# Altium project LampDimmer.PrjPcb
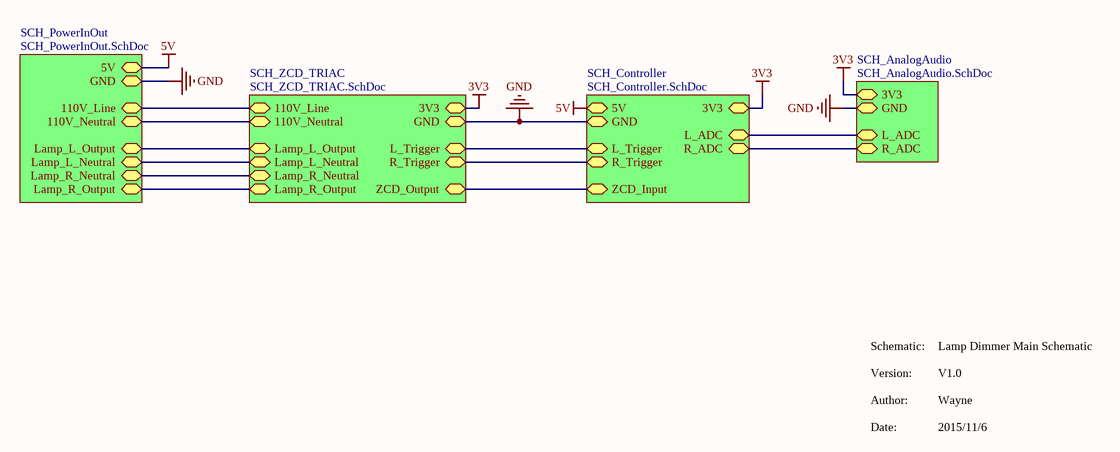
[diagram p0: SCH_Main.SchDoc]
2 sheets, 19 parts. Net scope: hierarchical (ports join the sheet entries above them; power ports are global).
Board file: PCB_LampDimmer.PcbDoc
Sheets:
  SCH_Main.SchDoc
    SCH_AnalogAudio = SCH_AnalogAudio.SchDoc

## Sheet SCH_Main.SchDoc
size 254 x 127 mm

### Sub-sheets
SCH_AnalogAudio = SCH_AnalogAudio.SchDoc: 3V3, GND, L_ADC, R_ADC
SCH_Controller = SCH_Controller.SchDoc (file not in this document): 5V, GND, 3V3, L_ADC, R_ADC, L_Trigger, R_Trigger, ZCD_Input
SCH_PowerInOut = SCH_PowerInOut.SchDoc (file not in this document): 110V_Line, 110V_Neutral, 5V, GND, Lamp_L_Neutral, Lamp_L_Output, Lamp_R_Neutral, Lamp_R_Output
SCH_ZCD_TRIAC = SCH_ZCD_TRIAC.SchDoc (file not in this document): 3V3, GND, 110V_Line, L_Trigger, R_Trigger, Lamp_L_Neutral, Lamp_L_Output, 110V_Neutral, Lamp_R_Output, Lamp_R_Neutral, ZCD_Output

### Nets
3V3: sheet SCH_Controller/3V3, sheet SCH_ZCD_TRIAC/3V3, sheet SCH_AnalogAudio/3V3
5V: sheet SCH_Controller/5V, sheet SCH_PowerInOut/5V
GND: sheet SCH_Controller/GND, sheet SCH_PowerInOut/GND, sheet SCH_ZCD_TRIAC/GND, sheet SCH_AnalogAudio/GND
L_ADC: sheet SCH_Controller/L_ADC, sheet SCH_AnalogAudio/L_ADC
R_ADC: sheet SCH_Controller/R_ADC, sheet SCH_AnalogAudio/R_ADC
(unnamed): sheet SCH_Controller/L_Trigger, sheet SCH_ZCD_TRIAC/L_Trigger
(unnamed): sheet SCH_Controller/R_Trigger, sheet SCH_ZCD_TRIAC/R_Trigger
(unnamed): sheet SCH_Controller/ZCD_Input, sheet SCH_ZCD_TRIAC/ZCD_Output
(unnamed): sheet SCH_PowerInOut/110V_Line, sheet SCH_ZCD_TRIAC/110V_Line
(unnamed): sheet SCH_PowerInOut/110V_Neutral, sheet SCH_ZCD_TRIAC/110V_Neutral
(unnamed): sheet SCH_PowerInOut/Lamp_L_Neutral, sheet SCH_ZCD_TRIAC/Lamp_L_Neutral
(unnamed): sheet SCH_PowerInOut/Lamp_L_Output, sheet SCH_ZCD_TRIAC/Lamp_L_Output
(unnamed): sheet SCH_PowerInOut/Lamp_R_Neutral, sheet SCH_ZCD_TRIAC/Lamp_R_Neutral
(unnamed): sheet SCH_PowerInOut/Lamp_R_Output, sheet SCH_ZCD_TRIAC/Lamp_R_Output

### Notes on the sheet
- Lamp Dimmer Main Schematic
- Schematic:
  Version:
  Author:
  Date:
- Wayne
- V1.0
- 2015/11/6

## Sheet SCH_AnalogAudio.SchDoc
size A4
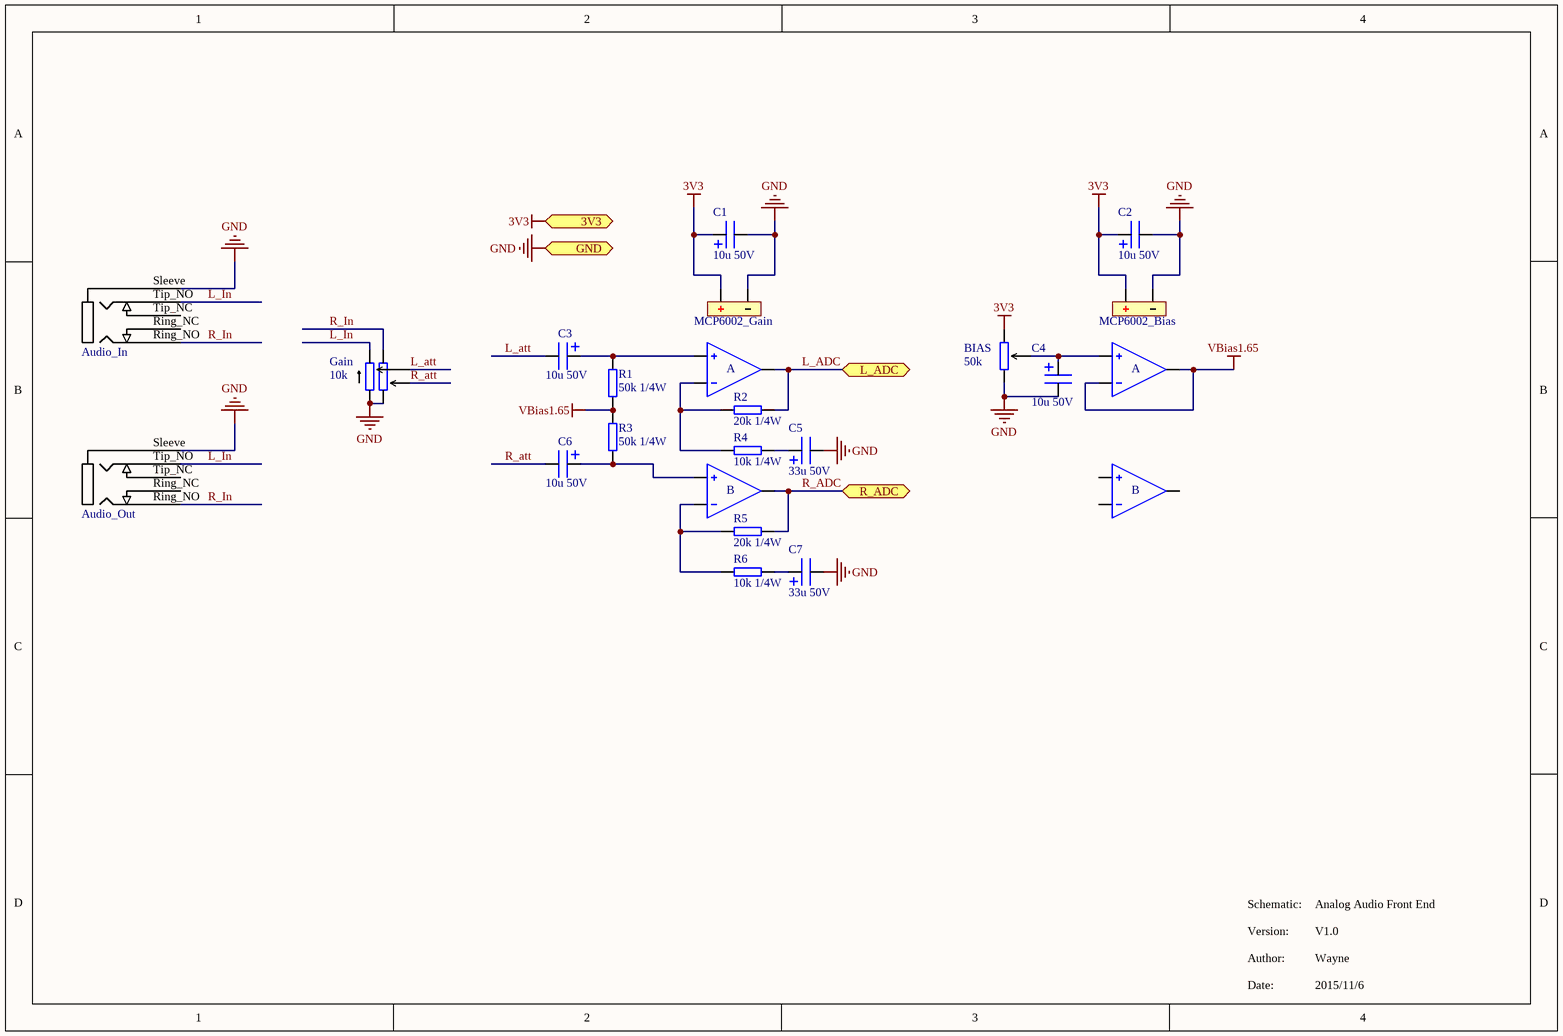
[diagram p1: SCH_AnalogAudio.SchDoc]

### Parts
Audio_In  Generic 3.5 PhoneJack 5 Pin through-hole  [3.5 PhoneJack 5 Pin]  (value not drawn)
Audio_Out  Generic 3.5 PhoneJack 5 Pin through-hole  [3.5 PhoneJack 5 Pin]  (value not drawn)
BIAS  value 50k  [POT 20T]  (hidden comment: POT 20T)
C1  value 10u 50V  [CAP Axial 5mm]  (hidden comment: Cap)
C2  value 10u 50V  [CAP Axial 5mm]  (hidden comment: Cap)
C3  value 10u 50V  [CAP Axial 5mm]  (hidden comment: Cap)
C4  value 10u 50V  [CAP Axial 5mm]  (hidden comment: Cap)
C5  value 33u 50V  [CAP Axial 5mm]  (hidden comment: Cap)
C6  value 10u 50V  [CAP Axial 5mm]  (hidden comment: Cap)
C7  value 33u 50V  [CAP Axial 5mm]  (hidden comment: Cap)
Gain  value 10k  [POT RK09L1240A12]  (hidden comment: Dual POT)
MCP6002_Bias  MCP6002  [DIP8]  (value not drawn)
MCP6002_Gain  MCP6002  [DIP8]  (value not drawn)
R1  value 50k 1/4W  [1/4W Res]  (hidden comment: Res)
R2  value 20k 1/4W  [1/4W Res]  (hidden comment: Res)
R3  value 50k 1/4W  [1/4W Res]  (hidden comment: Res)
R4  value 10k 1/4W  [1/4W Res]  (hidden comment: Res)
R5  value 20k 1/4W  [1/4W Res]  (hidden comment: Res)
R6  value 10k 1/4W  [1/4W Res]  (hidden comment: Res)

### Ports
3V3, GND, L_ADC, R_ADC

### Nets
3V3: BIAS.3 C1.2 C2.2 MCP6002_Bias.8(VDD) MCP6002_Gain.8(VDD) ; port 3V3
GND: Audio_In.Sleeve Audio_Out.Sleeve BIAS.1 C1.1 C2.1 C4.1 C5.1 C7.1 Gain.A1 Gain.B1 MCP6002_Bias.4(VSS) MCP6002_Gain.4(VSS) ; port GND
VBias1.65: MCP6002_Bias.1(VOUTA) MCP6002_Bias.2(VINA-) R1.1 R3.2
L_ADC: MCP6002_Gain.1(VOUTA) R2.1 ; port L_ADC
L_att: C3.1 Gain.A2
L_In: Audio_In.Tip_NO Audio_Out.Tip_NO Gain.A3
R_ADC: MCP6002_Gain.7(VOUTB) R5.1 ; port R_ADC
R_att: C6.1 Gain.B2
R_In: Audio_In.Ring_NO Audio_Out.Ring_NO Gain.B3
NetBIAS_2: BIAS.2 C4.2 MCP6002_Bias.3(VINA+)
NetC3_2: C3.2 MCP6002_Gain.3(VINA+) R1.2
NetC5_2: C5.2 R4.1
NetC6_2: C6.2 MCP6002_Gain.5(VINB+) R3.1
NetC7_2: C7.2 R6.1
NetMCP6002_Gain_2: MCP6002_Gain.2(VINA-) R2.2 R4.2
NetMCP6002_Gain_6: MCP6002_Gain.6(VINB-) R5.2 R6.2

Not connected (* = marked no-connect by the designer): Audio_In Ring_NC Tip_NC; Audio_Out Ring_NC Tip_NC; MCP6002_Bias 5(VINB+) 6(VINB-) 7(VOUTB)

### Notes on the sheet
- Analog Audio Front End
- Schematic:
  Version:
  Author:
  Date:
- Wayne
- V1.0
- 2015/11/6
- (in symbol MCP6002) A; B

### Library data of the parts
BIAS = POT 20T 3296W
C1-C7 = Axial Cap
Gain = ALPS POT RK09L1240A12
MCP6002_Bias MCP6002_Gain = MCP6002: MCP6002 RRIO Op Amp
R1-R6 = Axial Resistor